# Altium schematic sheet 驱动模块.SchDoc
size A4
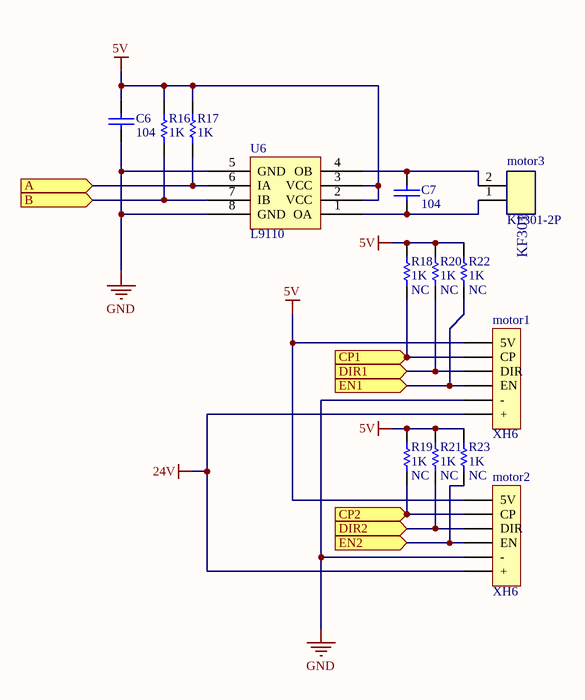
[diagram p0: 驱动模块.SchDoc]

## Parts
C6  value 104  [0603C]  (hidden comment: CAP)
C7  value 104  [0603C]  (hidden comment: CAP)
motor1  XH6  [XH6/2.54mm/180]
motor2  XH6  [XH6/2.54mm/180]
motor3  KF301-2P  [KF301-5.0-2P]
R16  value 1K  [0603R]  (hidden comment: RES)
R17  value 1K  [0603R]  (hidden comment: RES)
R18  value 1K  NOTE: NC  [0603R]  (hidden comment: RES)
R19  value 1K  NOTE: NC  [0603R]  (hidden comment: RES)
R20  value 1K  NOTE: NC  [0603R]  (hidden comment: RES)
R21  value 1K  NOTE: NC  [0603R]  (hidden comment: RES)
R22  value 1K  NOTE: NC  [0603R]  (hidden comment: RES)
R23  value 1K  NOTE: NC  [0603R]  (hidden comment: RES)
U6  L9110  [SOP8]

## Ports
A (in), B (in), CP1 (in), CP2 (in), DIR1 (in), DIR2 (in), EN1 (in), EN2 (in)

## Nets
5V: C6.2 motor1.1(5V) motor2.1(5V) R16.1 R17.1 R18.1 R19.1 R20.2 R21.1 R22.1 R23.1 U6.2(VCC) U6.3(VCC)
24V: motor1.6(+) motor2.6(+)
GND: C6.1 motor1.5(-) motor2.5(-) U6.5(GND) U6.8(GND)
A: R17.2 U6.6(IA) ; port A
B: R16.2 U6.7(IB) ; port B
CP1: motor1.2(CP) R18.2 ; port CP1
CP2: motor2.2(CP) R19.2 ; port CP2
DIR1: motor1.3(DIR) R20.1 ; port DIR1
DIR2: motor2.3(DIR) R21.2 ; port DIR2
EN1: motor1.4(EN) R22.2 ; port EN1
EN2: motor2.4(EN) R23.2 ; port EN2
NetC7_1: C7.1 motor3.1 U6.1(OA)
NetC7_2: C7.2 motor3.2 U6.4(OB)

## Notes on the sheet
- (in symbol KF301-2P) KF301

## Library data of the parts
C6 C7 = CAP: 无极性电容
R16-R23 = RES
  R18-R23: note: note